# Altium schematic sheet VALIX_Font14.SchDoc
size D
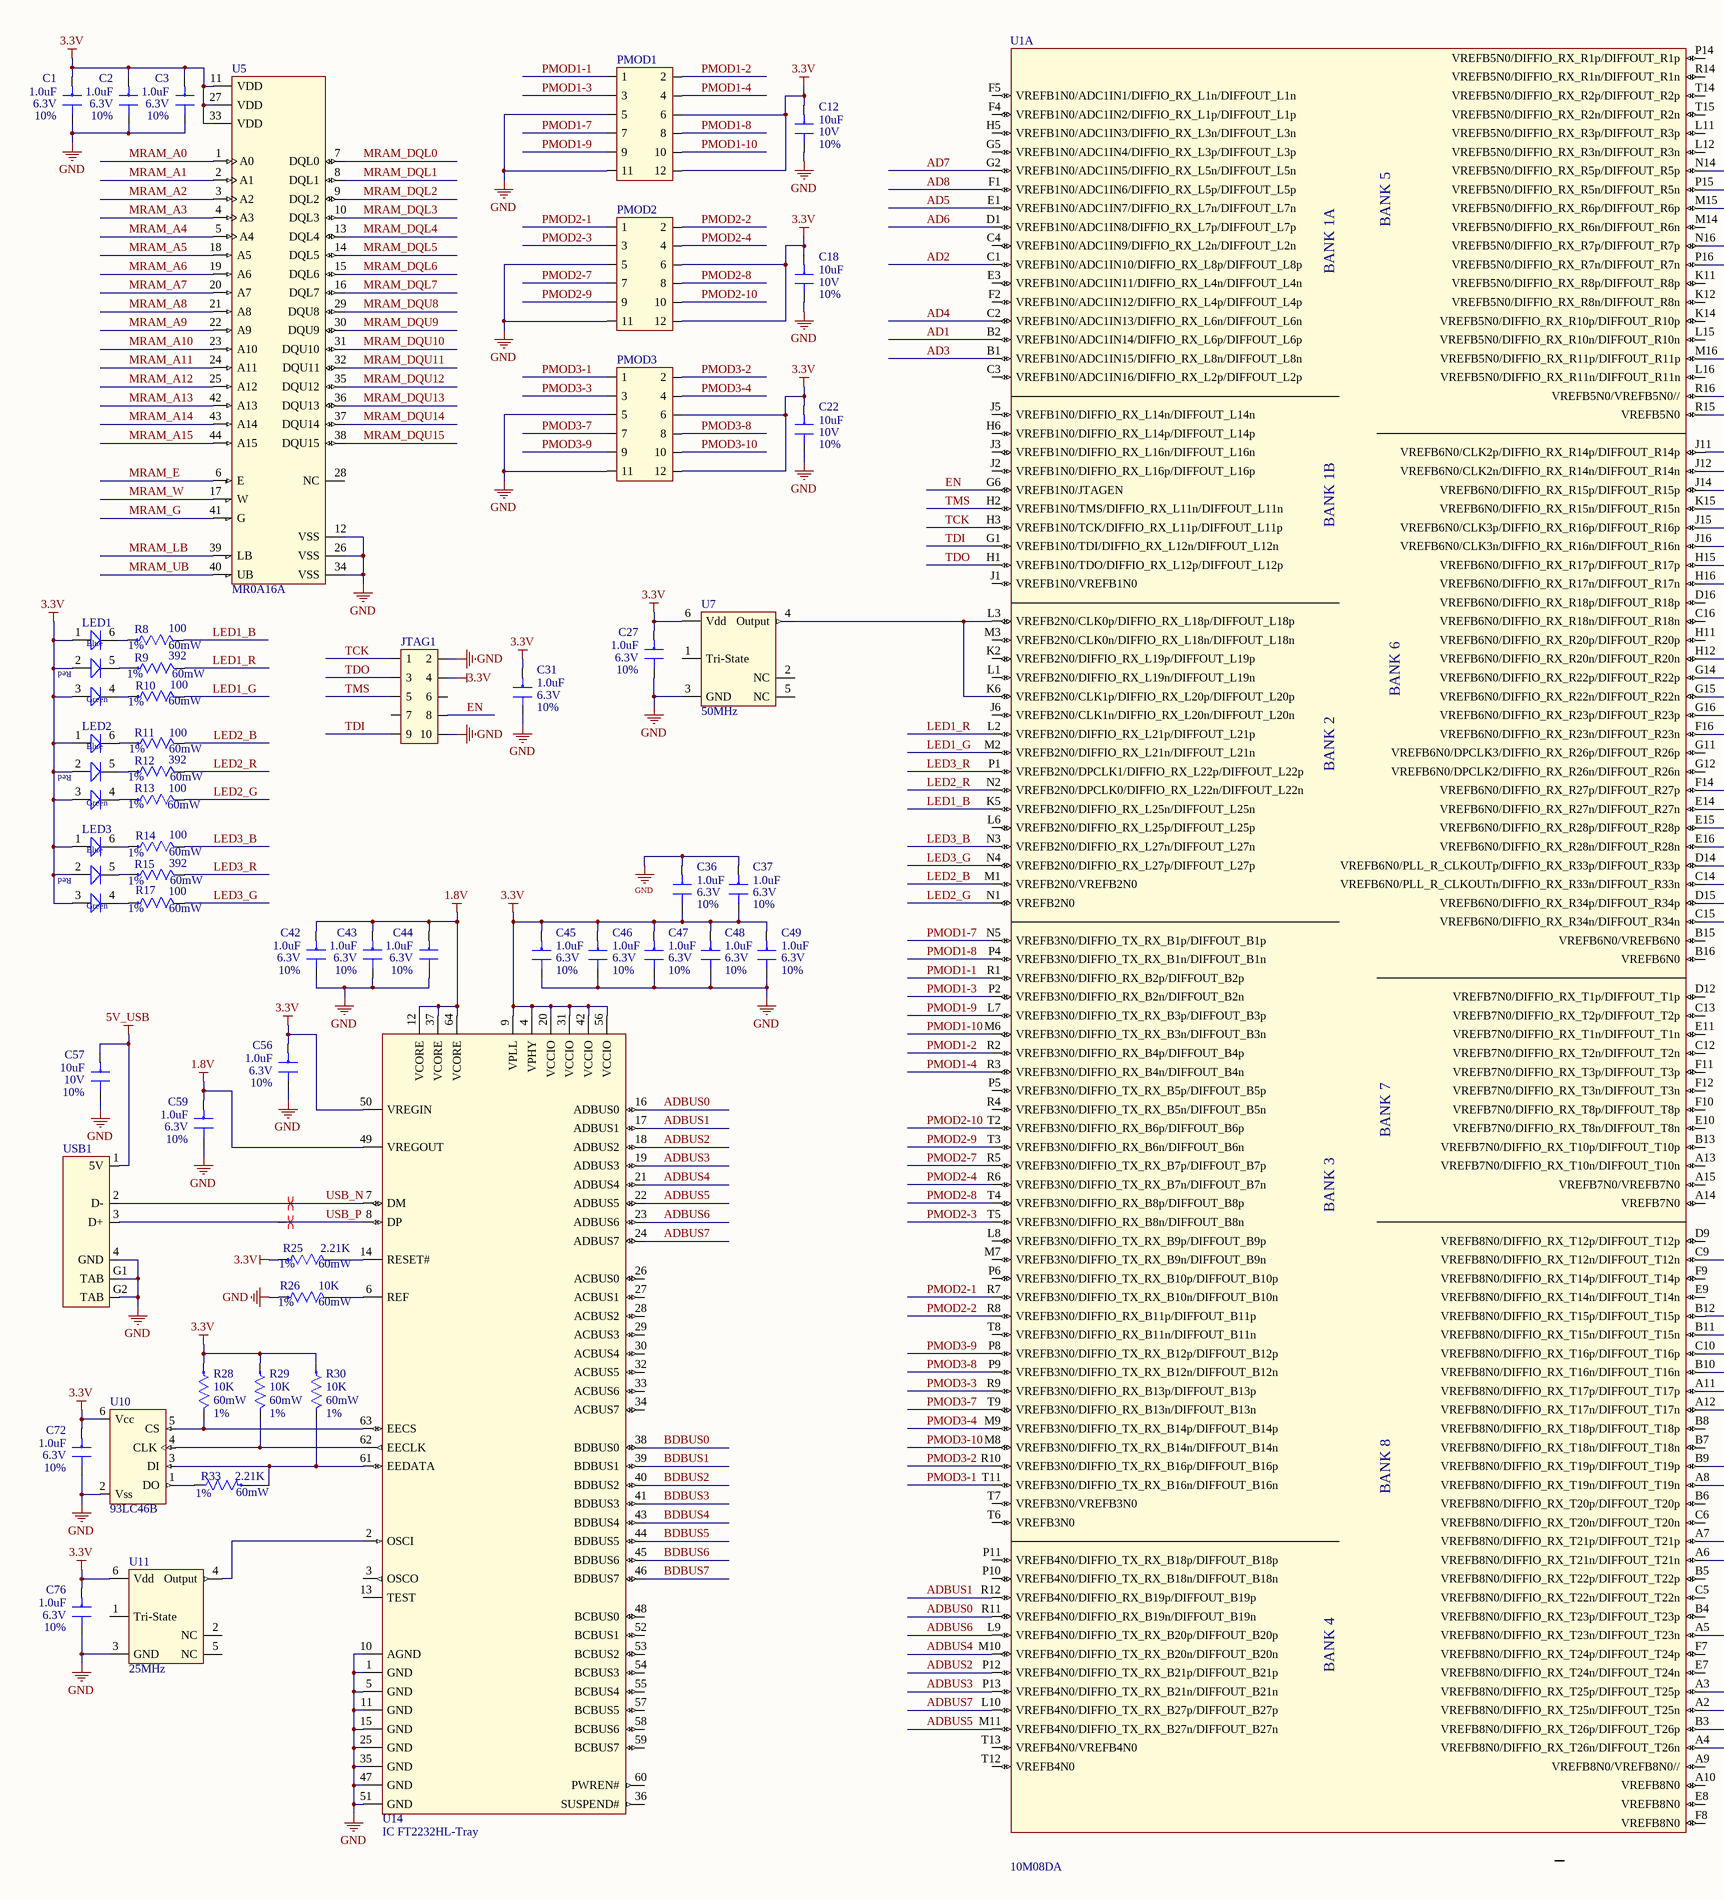
[diagram p0: VALIX_Font14.SchDoc, left]
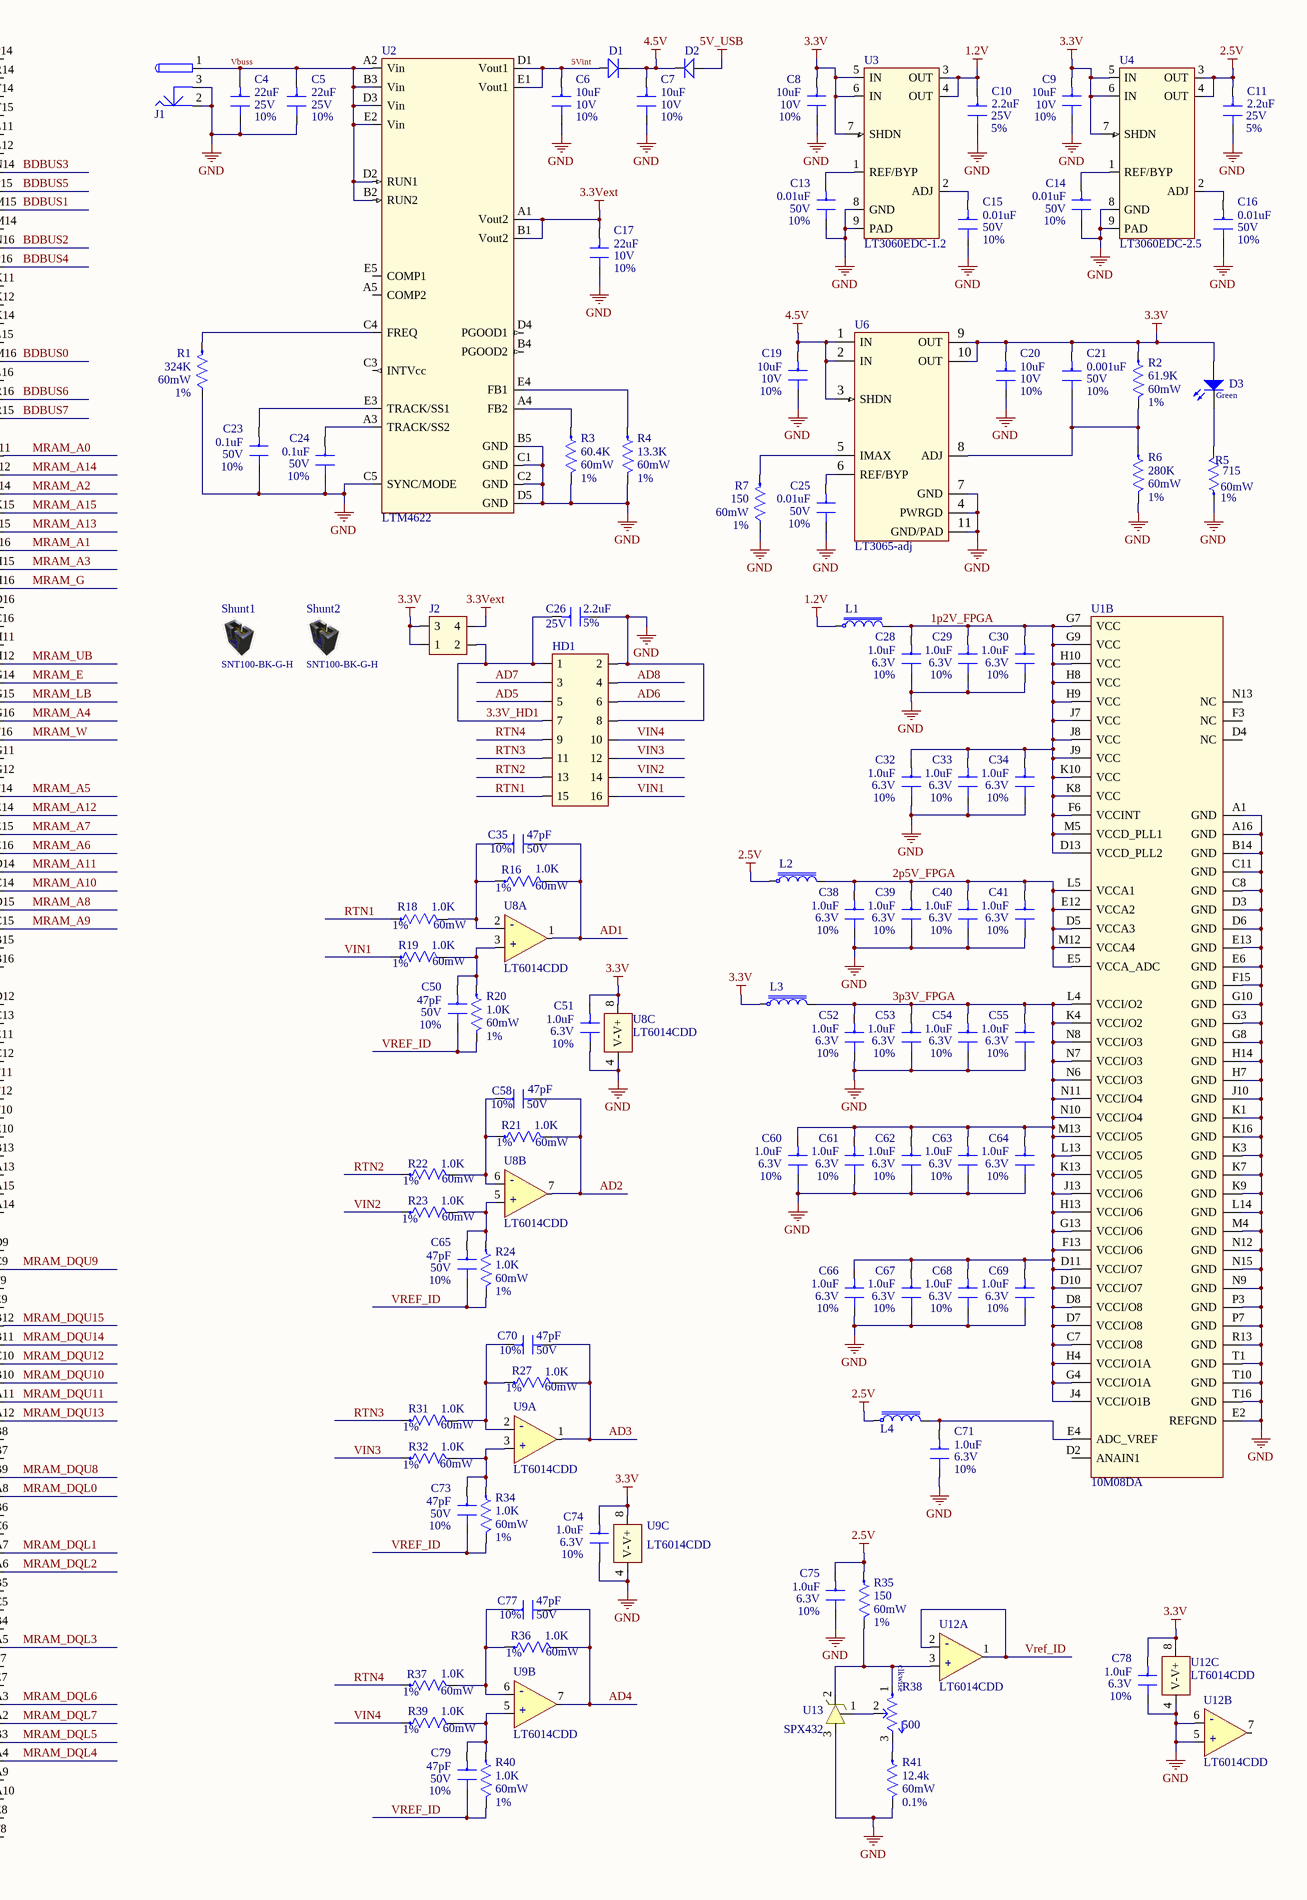
[diagram p1: VALIX_Font14.SchDoc, right]

## Parts
C1  value 1.0uF  Rating: 6.3V  Tolerance: 10%  [CC0402_p56_TLH]  (hidden comment: Cap 1.0uF 6.3V 0402 X7R)
C2  value 1.0uF  Rating: 6.3V  Tolerance: 10%  [CC0402_p56_TLH]  (hidden comment: Cap 1.0uF 6.3V 0402 X7R)
C3  value 1.0uF  Rating: 6.3V  Tolerance: 10%  [CC0402_p56_TLH]  (hidden comment: Cap 1.0uF 6.3V 0402 X7R)
C4  value 22uF  Rating: 25V  Tolerance: 10%  [CC1210_H1p6_20151019]  (hidden comment: Cap 22uF 10V 1210 X7R)
C5  value 22uF  Rating: 25V  Tolerance: 10%  [CC1210_H1p6_20151019]  (hidden comment: Cap 22uF 10V 1210 X7R)
C6  value 10uF  Rating: 10V  Tolerance: 10%  [CC0805_p94H_TLH]  (hidden comment: Cap 10uF 10V 0805 X7R)
C7  value 10uF  Rating: 10V  Tolerance: 10%  [CC0805_p94H_TLH]  (hidden comment: Cap 10uF 10V 0805 X7R)
C8  value 10uF  Rating: 10V  Tolerance: 10%  [CC0805_p94H_TLH]  (hidden comment: Cap 10uF 10V 0805 X7R)
C9  value 10uF  Rating: 10V  Tolerance: 10%  [CC0805_p94H_TLH]  (hidden comment: Cap 10uF 10V 0805 X7R)
C10  value 2.2uF  Rating: 25V  Tolerance: 5%  [CC0805_p94H_TLH]  (hidden comment: Cap 2.2uF 25V 0805 X7R)
C11  value 2.2uF  Rating: 25V  Tolerance: 5%  [CC0805_p94H_TLH]  (hidden comment: Cap 2.2uF 25V 0805 X7R)
C12  value 10uF  Rating: 10V  Tolerance: 10%  [CC0805_p94H_TLH]  (hidden comment: Cap 10uF 10V 0805 X7R)
C13  value 0.01uF  Rating: 50V  Tolerance: 10%  [CC0402_p56_TLH]  (hidden comment: Cap 0.01uF 50V 0402 X7R)
C14  value 0.01uF  Rating: 50V  Tolerance: 10%  [CC0402_p56_TLH]  (hidden comment: Cap 0.01uF 50V 0402 X7R)
C15  value 0.01uF  Rating: 50V  Tolerance: 10%  [CC0402_p56_TLH]  (hidden comment: Cap 0.01uF 50V 0402 X7R)
C16  value 0.01uF  Rating: 50V  Tolerance: 10%  [CC0402_p56_TLH]  (hidden comment: Cap 0.01uF 50V 0402 X7R)
C17  value 22uF  Rating: 10V  Tolerance: 10%  [C1206]  (hidden comment: Cap 22uF 10V 1206 X7R)
C18  value 10uF  Rating: 10V  Tolerance: 10%  [CC0805_p94H_TLH]  (hidden comment: Cap 10uF 10V 0805 X7R)
C19  value 10uF  Rating: 10V  Tolerance: 10%  [CC0805_p94H_TLH]  (hidden comment: Cap 10uF 10V 0805 X7R)
C20  value 10uF  Rating: 10V  Tolerance: 10%  [CC0805_p94H_TLH]  (hidden comment: Cap 10uF 10V 0805 X7R)
C21  value 0.001uF  Rating: 50V  Tolerance: 10%  [CC0402_p56_TLH]  (hidden comment: Cap 0.001uF 50V 0402 X7R)
C22  value 10uF  Rating: 10V  Tolerance: 10%  [CC0805_p94H_TLH]  (hidden comment: Cap 10uF 10V 0805 X7R)
C23  value 0.1uF  Rating: 50V  Tolerance: 10%  [CC0402_p56_TLH]  (hidden comment: Cap 0.1uF 50V 0402 X7R)
C24  value 0.1uF  Rating: 50V  Tolerance: 10%  [CC0402_p56_TLH]  (hidden comment: Cap 0.1uF 50V 0402 X7R)
C25  value 0.01uF  Rating: 50V  Tolerance: 10%  [CC0402_p56_TLH]  (hidden comment: Cap 0.01uF 50V 0402 X7R)
C26  value 2.2uF  Rating: 25V  Tolerance: 5%  [CC0805_p94H_TLH]  (hidden comment: Cap 2.2uF 25V 0805 X7R)
C27  value 1.0uF  Rating: 6.3V  Tolerance: 10%  [CC0402_p56_TLH]  (hidden comment: Cap 1.0uF 6.3V 0402 X7R)
C28  value 1.0uF  Rating: 6.3V  Tolerance: 10%  [CC0402_p56_TLH]  (hidden comment: Cap 1.0uF 6.3V 0402 X7R)
C29  value 1.0uF  Rating: 6.3V  Tolerance: 10%  [CC0402_p56_TLH]  (hidden comment: Cap 1.0uF 6.3V 0402 X7R)
C30  value 1.0uF  Rating: 6.3V  Tolerance: 10%  [CC0402_p56_TLH]  (hidden comment: Cap 1.0uF 6.3V 0402 X7R)
C31  value 1.0uF  Rating: 6.3V  Tolerance: 10%  [CC0402_p56_TLH]  (hidden comment: Cap 1.0uF 6.3V 0402 X7R)
C32  value 1.0uF  Rating: 6.3V  Tolerance: 10%  [CC0402_p56_TLH]  (hidden comment: Cap 1.0uF 6.3V 0402 X7R)
C33  value 1.0uF  Rating: 6.3V  Tolerance: 10%  [CC0402_p56_TLH]  (hidden comment: Cap 1.0uF 6.3V 0402 X7R)
C34  value 1.0uF  Rating: 6.3V  Tolerance: 10%  [CC0402_p56_TLH]  (hidden comment: Cap 1.0uF 6.3V 0402 X7R)
C35  value 47pF  Rating: 50V  Tolerance: 10%  [CC0402_p56_TLH]  (hidden comment: Cap 47pF 50V 0402 NPO)
C36  value 1.0uF  Rating: 6.3V  Tolerance: 10%  [CC0402_p56_TLH]  (hidden comment: Cap 1.0uF 6.3V 0402 X7R)
C37  value 1.0uF  Rating: 6.3V  Tolerance: 10%  [CC0402_p56_TLH]  (hidden comment: Cap 1.0uF 6.3V 0402 X7R)
C38  value 1.0uF  Rating: 6.3V  Tolerance: 10%  [CC0402_p56_TLH]  (hidden comment: Cap 1.0uF 6.3V 0402 X7R)
C39  value 1.0uF  Rating: 6.3V  Tolerance: 10%  [CC0402_p56_TLH]  (hidden comment: Cap 1.0uF 6.3V 0402 X7R)
C40  value 1.0uF  Rating: 6.3V  Tolerance: 10%  [CC0402_p56_TLH]  (hidden comment: Cap 1.0uF 6.3V 0402 X7R)
C41  value 1.0uF  Rating: 6.3V  Tolerance: 10%  [CC0402_p56_TLH]  (hidden comment: Cap 1.0uF 6.3V 0402 X7R)
C42  value 1.0uF  Rating: 6.3V  Tolerance: 10%  [CC0402_p56_TLH]  (hidden comment: Cap 1.0uF 6.3V 0402 X7R)
C43  value 1.0uF  Rating: 6.3V  Tolerance: 10%  [CC0402_p56_TLH]  (hidden comment: Cap 1.0uF 6.3V 0402 X7R)
C44  value 1.0uF  Rating: 6.3V  Tolerance: 10%  [CC0402_p56_TLH]  (hidden comment: Cap 1.0uF 6.3V 0402 X7R)
C45  value 1.0uF  Rating: 6.3V  Tolerance: 10%  [CC0402_p56_TLH]  (hidden comment: Cap 1.0uF 6.3V 0402 X7R)
C46  value 1.0uF  Rating: 6.3V  Tolerance: 10%  [CC0402_p56_TLH]  (hidden comment: Cap 1.0uF 6.3V 0402 X7R)
C47  value 1.0uF  Rating: 6.3V  Tolerance: 10%  [CC0402_p56_TLH]  (hidden comment: Cap 1.0uF 6.3V 0402 X7R)
C48  value 1.0uF  Rating: 6.3V  Tolerance: 10%  [CC0402_p56_TLH]  (hidden comment: Cap 1.0uF 6.3V 0402 X7R)
C49  value 1.0uF  Rating: 6.3V  Tolerance: 10%  [CC0402_p56_TLH]  (hidden comment: Cap 1.0uF 6.3V 0402 X7R)
C50  value 47pF  Rating: 50V  Tolerance: 10%  [CC0402_p56_TLH]  (hidden comment: Cap 47pF 50V 0402 NPO)
C51  value 1.0uF  Rating: 6.3V  Tolerance: 10%  [CC0402_p56_TLH]  (hidden comment: Cap 1.0uF 6.3V 0402 X7R)
C52  value 1.0uF  Rating: 6.3V  Tolerance: 10%  [CC0402_p56_TLH]  (hidden comment: Cap 1.0uF 6.3V 0402 X7R)
C53  value 1.0uF  Rating: 6.3V  Tolerance: 10%  [CC0402_p56_TLH]  (hidden comment: Cap 1.0uF 6.3V 0402 X7R)
C54  value 1.0uF  Rating: 6.3V  Tolerance: 10%  [CC0402_p56_TLH]  (hidden comment: Cap 1.0uF 6.3V 0402 X7R)
C55  value 1.0uF  Rating: 6.3V  Tolerance: 10%  [CC0402_p56_TLH]  (hidden comment: Cap 1.0uF 6.3V 0402 X7R)
C56  value 1.0uF  Rating: 6.3V  Tolerance: 10%  [CC0402_p56_TLH]  (hidden comment: Cap 1.0uF 6.3V 0402 X7R)
C57  value 10uF  Rating: 10V  Tolerance: 10%  [CC0805_p94H_TLH]  (hidden comment: Cap 10uF 10V 0805 X7R)
C58  value 47pF  Rating: 50V  Tolerance: 10%  [CC0402_p56_TLH]  (hidden comment: Cap 47pF 50V 0402 NPO)
C59  value 1.0uF  Rating: 6.3V  Tolerance: 10%  [CC0402_p56_TLH]  (hidden comment: Cap 1.0uF 6.3V 0402 X7R)
C60  value 1.0uF  Rating: 6.3V  Tolerance: 10%  [CC0402_p56_TLH]  (hidden comment: Cap 1.0uF 6.3V 0402 X7R)
C61  value 1.0uF  Rating: 6.3V  Tolerance: 10%  [CC0402_p56_TLH]  (hidden comment: Cap 1.0uF 6.3V 0402 X7R)
C62  value 1.0uF  Rating: 6.3V  Tolerance: 10%  [CC0402_p56_TLH]  (hidden comment: Cap 1.0uF 6.3V 0402 X7R)
C63  value 1.0uF  Rating: 6.3V  Tolerance: 10%  [CC0402_p56_TLH]  (hidden comment: Cap 1.0uF 6.3V 0402 X7R)
C64  value 1.0uF  Rating: 6.3V  Tolerance: 10%  [CC0402_p56_TLH]  (hidden comment: Cap 1.0uF 6.3V 0402 X7R)
C65  value 47pF  Rating: 50V  Tolerance: 10%  [CC0402_p56_TLH]  (hidden comment: Cap 47pF 50V 0402 NPO)
C66  value 1.0uF  Rating: 6.3V  Tolerance: 10%  [CC0402_p56_TLH]  (hidden comment: Cap 1.0uF 6.3V 0402 X7R)
C67  value 1.0uF  Rating: 6.3V  Tolerance: 10%  [CC0402_p56_TLH]  (hidden comment: Cap 1.0uF 6.3V 0402 X7R)
C68  value 1.0uF  Rating: 6.3V  Tolerance: 10%  [CC0402_p56_TLH]  (hidden comment: Cap 1.0uF 6.3V 0402 X7R)
C69  value 1.0uF  Rating: 6.3V  Tolerance: 10%  [CC0402_p56_TLH]  (hidden comment: Cap 1.0uF 6.3V 0402 X7R)
C70  value 47pF  Rating: 50V  Tolerance: 10%  [CC0402_p56_TLH]  (hidden comment: Cap 47pF 50V 0402 NPO)
C71  value 1.0uF  Rating: 6.3V  Tolerance: 10%  [CC0402_p56_TLH]  (hidden comment: Cap 1.0uF 6.3V 0402 X7R)
C72  value 1.0uF  Rating: 6.3V  Tolerance: 10%  [CC0402_p56_TLH]  (hidden comment: Cap 1.0uF 6.3V 0402 X7R)
C73  value 47pF  Rating: 50V  Tolerance: 10%  [CC0402_p56_TLH]  (hidden comment: Cap 47pF 50V 0402 NPO)
C74  value 1.0uF  Rating: 6.3V  Tolerance: 10%  [CC0402_p56_TLH]  (hidden comment: Cap 1.0uF 6.3V 0402 X7R)
C75  value 1.0uF  Rating: 6.3V  Tolerance: 10%  [CC0402_p56_TLH]  (hidden comment: Cap 1.0uF 6.3V 0402 X7R)
C76  value 1.0uF  Rating: 6.3V  Tolerance: 10%  [CC0402_p56_TLH]  (hidden comment: Cap 1.0uF 6.3V 0402 X7R)
C77  value 47pF  Rating: 50V  Tolerance: 10%  [CC0402_p56_TLH]  (hidden comment: Cap 47pF 50V 0402 NPO)
C78  value 1.0uF  Rating: 6.3V  Tolerance: 10%  [CC0402_p56_TLH]  (hidden comment: Cap 1.0uF 6.3V 0402 X7R)
C79  value 47pF  Rating: 50V  Tolerance: 10%  [CC0402_p56_TLH]  (hidden comment: Cap 47pF 50V 0402 NPO)
D1  Diode 40V 3A  [SMA_SOICJ127P600-8N]  (value not drawn)
D2  Diode 40V 3A  [SMA_SOICJ127P600-8N]  (value not drawn)
D3  Color: Green  [CC0402_p56_TLH - LED]  (hidden comment: SML-P11MT)
HD1  Conn Recept 8x2x0.1 TH SSW  [Conn Recept 8x2x8p35 0p1PH TH]  (value not drawn)
J1  Conn PWR 2.0 5A 24V TH Barrel  [KLD-0202]  (value not drawn)
J2  Header 2x2 100Pitch  [Header_2x2x0p100e]  (value not drawn)
JTAG1  Header 2x5 100Pitch  [Header_2x5_100x100]  (value not drawn)
L1  FB 0.5A 80mohm 0402  [Chip2PinSM127P600-8N_TLH20150921]  (value not drawn)
L2  FB 0.5A 80mohm 0402  [Chip2PinSM127P600-8N_TLH20150921]  (value not drawn)
L3  FB 0.5A 80mohm 0402  [Chip2PinSM127P600-8N_TLH20150921]  (value not drawn)
L4  FB 0.5A 80mohm 0402  [Chip2PinSM127P600-8N_TLH20150921]  (value not drawn)
LED1  LED RGB  [LED_RGB_1p5x1p0x0p2_6pin_SON57P100X256N]  (value not drawn)
LED2  LED RGB  [LED_RGB_1p5x1p0x0p2_6pin_SON57P100X256N]  (value not drawn)
LED3  LED RGB  [LED_RGB_1p5x1p0x0p2_6pin_SON57P100X256N]  (value not drawn)
PMOD1  Conn Recept 6x2x0.1 TH SSW  [Conn Recept 6x2x8p35 0p1PH TH]  (value not drawn)
PMOD2  Conn Recept 6x2x0.1 TH SSW  [Conn Recept 6x2x8p35 0p1PH TH]  (value not drawn)
PMOD3  Conn Recept 6x2x0.1 TH SSW  [Conn Recept 6x2x8p35 0p1PH TH]  (value not drawn)
R1  Rating: 60mW  Tolerance: 1%  [CC0402_p56_TLH]  (hidden comment: 324K)
R2  Rating: 60mW  Tolerance: 1%  [CC0402_p56_TLH]  (hidden comment: 61.9K)
R3  Rating: 60mW  Tolerance: 1%  [CC0402_p56_TLH]  (hidden comment: 60.4K)
R4  Rating: 60mW  Tolerance: 1%  [CC0402_p56_TLH]  (hidden comment: 13.3K)
R5  Rating: 60mW  Tolerance: 1%  [CC0402_p56_TLH]  (hidden comment: 715)
R6  Rating: 60mW  Tolerance: 1%  [CC0402_p56_TLH]  (hidden comment: 280K)
R7  Rating: 60mW  Tolerance: 1%  [CC0402_p56_TLH]  (hidden comment: 150)
R8  Rating: 60mW  Tolerance: 1%  [CC0402_p56_TLH]  (hidden comment: 100)
R9  Rating: 60mW  Tolerance: 1%  [CC0402_p56_TLH]  (hidden comment: 392)
R10  Rating: 60mW  Tolerance: 1%  [CC0402_p56_TLH]  (hidden comment: 100)
R11  Rating: 60mW  Tolerance: 1%  [CC0402_p56_TLH]  (hidden comment: 100)
R12  Rating: 60mW  Tolerance: 1%  [CC0402_p56_TLH]  (hidden comment: 392)
R13  Rating: 60mW  Tolerance: 1%  [CC0402_p56_TLH]  (hidden comment: 100)
R14  Rating: 60mW  Tolerance: 1%  [CC0402_p56_TLH]  (hidden comment: 100)
R15  Rating: 60mW  Tolerance: 1%  [CC0402_p56_TLH]  (hidden comment: 392)
R16  Rating: 60mW  Tolerance: 1%  [CC0402_p56_TLH]  (hidden comment: 1.0K)
R17  Rating: 60mW  Tolerance: 1%  [CC0402_p56_TLH]  (hidden comment: 100)
R18  Rating: 60mW  Tolerance: 1%  [CC0402_p56_TLH]  (hidden comment: 1.0K)
R19  Rating: 60mW  Tolerance: 1%  [CC0402_p56_TLH]  (hidden comment: 1.0K)
R20  Rating: 60mW  Tolerance: 1%  [CC0402_p56_TLH]  (hidden comment: 1.0K)
R21  Rating: 60mW  Tolerance: 1%  [CC0402_p56_TLH]  (hidden comment: 1.0K)
R22  Rating: 60mW  Tolerance: 1%  [CC0402_p56_TLH]  (hidden comment: 1.0K)
R23  Rating: 60mW  Tolerance: 1%  [CC0402_p56_TLH]  (hidden comment: 1.0K)
R24  Rating: 60mW  Tolerance: 1%  [CC0402_p56_TLH]  (hidden comment: 1.0K)
R25  Rating: 60mW  Tolerance: 1%  [CC0402_p56_TLH]  (hidden comment: 2.21K)
R26  Rating: 60mW  Tolerance: 1%  [CC0402_p56_TLH]  (hidden comment: 10K)
R27  Rating: 60mW  Tolerance: 1%  [CC0402_p56_TLH]  (hidden comment: 1.0K)
R28  Rating: 60mW  Tolerance: 1%  [CC0402_p56_TLH]  (hidden comment: 10K)
R29  Rating: 60mW  Tolerance: 1%  [CC0402_p56_TLH]  (hidden comment: 10K)
R30  Rating: 60mW  Tolerance: 1%  [CC0402_p56_TLH]  (hidden comment: 10K)
R31  Rating: 60mW  Tolerance: 1%  [CC0402_p56_TLH]  (hidden comment: 1.0K)
R32  Rating: 60mW  Tolerance: 1%  [CC0402_p56_TLH]  (hidden comment: 1.0K)
R33  Rating: 60mW  Tolerance: 1%  [CC0402_p56_TLH]  (hidden comment: 2.21K)
R34  Rating: 60mW  Tolerance: 1%  [CC0402_p56_TLH]  (hidden comment: 1.0K)
R35  Rating: 60mW  Tolerance: 1%  [CC0402_p56_TLH]  (hidden comment: 150)
R36  Rating: 60mW  Tolerance: 1%  [CC0402_p56_TLH]  (hidden comment: 1.0K)
R37  Rating: 60mW  Tolerance: 1%  [CC0402_p56_TLH]  (hidden comment: 1.0K)
R38  500  [RES_ Pot_3pin_318x231x416_Bourns3223W]
R39  Rating: 60mW  Tolerance: 1%  [CC0402_p56_TLH]  (hidden comment: 1.0K)
R40  Rating: 60mW  Tolerance: 1%  [CC0402_p56_TLH]  (hidden comment: 1.0K)
R41  Rating: 60mW  Tolerance: 0.1%  [CC0402_p56_TLH]  (hidden comment: 12.4k)
Shunt1  Manufacture Part number: SNT100-BK-G-H  (hidden comment: Shunt)  (mechanical)
Shunt2  Manufacture Part number: SNT100-BK-G-H  (hidden comment: Shunt)  (mechanical)
U1  10M08DA  [BGA256C100P16X16_1700X1700X155]  (parts A,B of 2)
U2  LTM4622  [LGA25C127P5X5_625X625X182_20131105]
U3  LT3060EDC-1.2  [DFN8_2x3_SON45P300X80_HS-9N]
U4  LT3060EDC-2.5  [DFN8_2x3_SON45P300X80_HS-9N]
U5  MR0A16A  [TSOP44_80P1180X120-44N]
U6  LT3065-adj  [DFN10_SON50P300X80_HS-11N_TLH_20151107]
U7  50MHz  [SON254P500X85_HS-7N_Oss]
U8  LT6014CDD  [DFN8_3x3_SON50P300X80_HS-9N_20151201]  (parts A,B,C of 3)
U9  LT6014CDD  [DFN8_3x3_SON50P300X80_HS-9N_20151201]  (parts A,B,C of 3)
U10  93LC46B  [SO-G6/E2.4]
U11  25MHz  [SON254P500X85_HS-7N_Oss]
U12  LT6014CDD  [DFN8_3x3_SON50P300X80_HS-9N_20151201]  (parts A,B,C of 3)
U13  SPX432  [SOT23_SOT95P245X112-3N_20151202]
U14  IC FT2232HL-Tray  [LQFP-64_N]
USB1  Conn USB A TH RT  [Connector USB A 4Pin Plug RT]  (value not drawn)

## Nets
1.2V: C10.1 L1.1 U3.3(OUT) U3.4(OUT)
1.8V: C42.1 C43.1 C44.1 C59.1 U14.12(VCORE) U14.37(VCORE) U14.49(VREGOUT) U14.64(VCORE)
2.5V: C11.1 C75.1 L2.1 L4.1 R35.1 U4.3(OUT) U4.4(OUT)
3.3V: C1.1 C2.1 C3.1 C8.1 C9.1 C12.1 C18.1 C20.1 C21.1 C22.1 C27.1 C31.1 C36.2 C37.2 C45.1 C46.1 C47.1 C48.1 C49.1 C51.1 C56.1 C72.1 C74.1 C76.1 C78.1 D3.1(A) J2.1 J2.3 JTAG1.4 L3.1 LED1.1(BLue_Anode) LED1.2(Red_Anode) LED1.3(Green_Anode) LED2.1(BLue_Anode) LED2.2(Red_Anode) LED2.3(Green_Anode) LED3.1(BLue_Anode) LED3.2(Red_Anode) LED3.3(Green_Anode) PMOD1.6 PMOD1.12 PMOD2.6 PMOD2.12 PMOD3.6 PMOD3.12 R2.1 R25.1 R28.1 R29.1 R30.1 U3.5(IN) U3.6(IN) U3.7(SHDN) U4.5(IN) U4.6(IN) U4.7(SHDN) U5.11(VDD) U5.27(VDD) U5.33(VDD) U6.9(OUT) U6.10(OUT) U7.6(Vdd) U8.8(V+) U9.8(V+) U10.6(Vcc) U11.6(Vdd) U12.8(V+) U14.4(VPHY) U14.9(VPLL) U14.20(VCCIO) U14.31(VCCIO) U14.42(VCCIO) U14.50(VREGIN) U14.56(VCCIO)
3.3Vext: C17.1 J2.4 U2.A1(Vout2) U2.B1(Vout2)
4.5V: C7.1 C19.1 D1.1(C_NEG) D2.1(C_NEG) U6.1(IN) U6.2(IN) U6.3(SHDN)
5V_USB: C57.1 D2.2(A_POS) USB1.1(5V)
GND: C1.2 C2.2 C3.2 C4.2 C5.2 C6.2 C7.2 C8.2 C9.2 C10.2 C11.2 C12.2 C13.2 C14.2 C15.2 C16.2 C17.2 C18.2 C19.2 C20.2 C22.2 C23.2 C24.2 C25.2 C26.2 C27.2 C28.2 C29.2 C30.2 C31.2 C32.2 C33.2 C34.2 C36.1 C37.1 C38.2 C39.2 C40.2 C41.2 C42.2 C43.2 C44.2 C45.2 C46.2 C47.2 C48.2 C49.2 C51.2 C52.2 C53.2 C54.2 C55.2 C56.2 C57.2 C59.2 C60.2 C61.2 C62.2 C63.2 C64.2 C66.2 C67.2 C68.2 C69.2 C71.2 C72.2 C74.2 C75.2 C76.2 C78.2 HD1.2 HD1.8 J1.2 J1.3 JTAG1.2 JTAG1.10 PMOD1.5 PMOD1.11 PMOD2.5 PMOD2.11 PMOD3.5 PMOD3.11 R1.2 R3.2 R4.2 R5.1 R6.2 R7.2 R26.1 R41.2 U1.A1(GND) U1.A16(GND) U1.B14(GND) U1.C8(GND) U1.C11(GND) U1.D3(GND) U1.D6(GND) U1.E2(REFGND) U1.E6(GND) U1.E13(GND) U1.F15(GND) U1.G3(GND) U1.G8(GND) U1.G10(GND) U1.H7(GND) U1.H14(GND) U1.J10(GND) U1.K1(GND) U1.K3(GND) U1.K7(GND) U1.K9(GND) U1.K16(GND) U1.L14(GND) U1.M4(GND) U1.N9(GND) U1.N12(GND) U1.N15(GND) U1.P3(GND) U1.P7(GND) U1.R13(GND) U1.T1(GND) U1.T10(GND) U1.T16(GND) U2.B5(GND) U2.C1(GND) U2.C2(GND) U2.C5(SYNC/MODE) U2.D5(GND) U3.8(GND) U3.9(PAD) U4.8(GND) U4.9(PAD) U5.12(VSS) U5.26(VSS) U5.34(VSS) U6.4(PWRGD) U6.7(GND) U6.11(GND/PAD) U7.3(GND) U8.4(V-) U9.4(V-) U10.2(Vss) U11.3(GND) U12.4(V-) U12.5(+) U12.6(inb-) U13.3(Anode) U14.1(GND) U14.5(GND) U14.10(AGND) U14.11(GND) U14.15(GND) U14.25(GND) U14.35(GND) U14.47(GND) U14.51(GND) USB1.4(GND) USB1.G1(TAB) USB1.G2(TAB)
1p2V_FPGA: C28.1 C29.1 C30.1 C32.1 C33.1 C34.1 L1.2 U1.D13(VCCD_PLL2) U1.F6(VCCINT) U1.G7(VCC) U1.G9(VCC) U1.H8(VCC) U1.H9(VCC) U1.H10(VCC) U1.J7(VCC) U1.J8(VCC) U1.J9(VCC) U1.K8(VCC) U1.K10(VCC) U1.M5(VCCD_PLL1)
2p5V_FPGA: C38.1 C39.1 C40.1 C41.1 L2.2 U1.D5(VCCA3) U1.E5(VCCA_ADC) U1.E12(VCCA2) U1.L5(VCCA1) U1.M12(VCCA4)
3.3V_HD1: C26.1 HD1.1 HD1.7 J2.2
3p3V_FPGA: C52.1 C53.1 C54.1 C55.1 C60.1 C61.1 C62.1 C63.1 C64.1 C66.1 C67.1 C68.1 C69.1 L3.2 U1.C7(VCCI/O8) U1.D7(VCCI/O8) U1.D8(VCCI/O8) U1.D10(VCCI/O7) U1.D11(VCCI/O7) U1.F13(VCCI/O6) U1.G4(VCCI/O1A) U1.G13(VCCI/O6) U1.H4(VCCI/O1A) U1.H13(VCCI/O6) U1.J4(VCCI/O1B) U1.J13(VCCI/O6) U1.K4(VCCI/O2) U1.K13(VCCI/O5) U1.L4(VCCI/O2) U1.L13(VCCI/O5) U1.M13(VCCI/O5) U1.N6(VCCI/O3) U1.N7(VCCI/O3) U1.N8(VCCI/O3) U1.N10(VCCI/O4) U1.N11(VCCI/O4)
5Vint: C6.1 D1.2(A_POS) U2.D1(Vout1) U2.E1(Vout1)
AD1: C35.2 R16.2 U1.B2(VREFB1N0/ADC1IN14/DIFFIO_RX_L6p/DIFFOUT_L6p) U8.1(Vouta)
AD2: C58.2 R21.2 U1.C1(VREFB1N0/ADC1IN10/DIFFIO_RX_L8p/DIFFOUT_L8p) U8.7(Voutb)
AD3: C70.2 R27.2 U1.B1(VREFB1N0/ADC1IN15/DIFFIO_RX_L8n/DIFFOUT_L8n) U9.1(Vouta)
AD4: C77.2 R36.2 U1.C2(VREFB1N0/ADC1IN13/DIFFIO_RX_L6n/DIFFOUT_L6n) U9.7(Voutb)
AD5: HD1.5 U1.E1(VREFB1N0/ADC1IN7/DIFFIO_RX_L7n/DIFFOUT_L7n)
AD6: HD1.6 U1.D1(VREFB1N0/ADC1IN8/DIFFIO_RX_L7p/DIFFOUT_L7p)
AD7: HD1.3 U1.G2(VREFB1N0/ADC1IN5/DIFFIO_RX_L5n/DIFFOUT_L5n)
AD8: HD1.4 U1.F1(VREFB1N0/ADC1IN6/DIFFIO_RX_L5p/DIFFOUT_L5p)
ADBUS0: U1.R11(VREFB4N0/DIFFIO_RX_B19n/DIFFOUT_B19n) U14.16(ADBUS0)
ADBUS1: U1.R12(VREFB4N0/DIFFIO_RX_B19p/DIFFOUT_B19p) U14.17(ADBUS1)
ADBUS2: U1.P12(VREFB4N0/DIFFIO_TX_RX_B21p/DIFFOUT_B21p) U14.18(ADBUS2)
ADBUS3: U1.P13(VREFB4N0/DIFFIO_TX_RX_B21n/DIFFOUT_B21n) U14.19(ADBUS3)
ADBUS4: U1.M10(VREFB4N0/DIFFIO_TX_RX_B20n/DIFFOUT_B20n) U14.21(ADBUS4)
ADBUS5: U1.M11(VREFB4N0/DIFFIO_TX_RX_B27n/DIFFOUT_B27n) U14.22(ADBUS5)
ADBUS6: U1.L9(VREFB4N0/DIFFIO_TX_RX_B20p/DIFFOUT_B20p) U14.23(ADBUS6)
ADBUS7: U1.L10(VREFB4N0/DIFFIO_TX_RX_B27p/DIFFOUT_B27p) U14.24(ADBUS7)
BDBUS0: U1.M16(VREFB5N0/DIFFIO_RX_R11p/DIFFOUT_R11p) U14.38(BDBUS0)
BDBUS1: U1.M15(VREFB5N0/DIFFIO_RX_R6p/DIFFOUT_R6p) U14.39(BDBUS1)
BDBUS2: U1.N16(VREFB5N0/DIFFIO_RX_R7p/DIFFOUT_R7p) U14.40(BDBUS2)
BDBUS3: U1.N14(VREFB5N0/DIFFIO_RX_R5p/DIFFOUT_R5p) U14.41(BDBUS3)
BDBUS4: U1.P16(VREFB5N0/DIFFIO_RX_R7n/DIFFOUT_R7n) U14.43(BDBUS4)
BDBUS5: U1.P15(VREFB5N0/DIFFIO_RX_R5n/DIFFOUT_R5n) U14.44(BDBUS5)
BDBUS6: U1.R16(VREFB5N0/VREFB5N0//) U14.45(BDBUS6)
BDBUS7: U1.R15(VREFB5N0) U14.46(BDBUS7)
EN: JTAG1.8 U1.G6(VREFB1N0/JTAGEN)
LED1_B: R8.2 U1.K5(VREFB2N0/DIFFIO_RX_L25n/DIFFOUT_L25n)
LED1_G: R10.2 U1.M2(VREFB2N0/DIFFIO_RX_L21n/DIFFOUT_L21n)
LED1_R: R9.2 U1.L2(VREFB2N0/DIFFIO_RX_L21p/DIFFOUT_L21p)
LED2_B: R11.2 U1.M1(VREFB2N0/VREFB2N0)
LED2_G: R13.2 U1.N1(VREFB2N0)
LED2_R: R12.2 U1.N2(VREFB2N0/DPCLK0/DIFFIO_RX_L22n/DIFFOUT_L22n)
LED3_B: R14.2 U1.N3(VREFB2N0/DIFFIO_RX_L27n/DIFFOUT_L27n)
LED3_G: R17.2 U1.N4(VREFB2N0/DIFFIO_RX_L27p/DIFFOUT_L27p)
LED3_R: R15.2 U1.P1(VREFB2N0/DPCLK1/DIFFIO_RX_L22p/DIFFOUT_L22p)
MRAM_A0: U1.J11(VREFB6N0/CLK2p/DIFFIO_RX_R14p/DIFFOUT_R14p) U5.1(A0)
MRAM_A1: U1.J16(VREFB6N0/CLK3n/DIFFIO_RX_R16n/DIFFOUT_R16n) U5.2(A1)
MRAM_A2: U1.J14(VREFB6N0/DIFFIO_RX_R15p/DIFFOUT_R15p) U5.3(A2)
MRAM_A3: U1.H15(VREFB6N0/DIFFIO_RX_R17p/DIFFOUT_R17p) U5.4(A3)
MRAM_A4: U1.G16(VREFB6N0/DIFFIO_RX_R23p/DIFFOUT_R23p) U5.5(A4)
MRAM_A5: U1.F14(VREFB6N0/DIFFIO_RX_R27p/DIFFOUT_R27p) U5.18(A5)
MRAM_A6: U1.E16(VREFB6N0/DIFFIO_RX_R28n/DIFFOUT_R28n) U5.19(A6)
MRAM_A7: U1.E15(VREFB6N0/DIFFIO_RX_R28p/DIFFOUT_R28p) U5.20(A7)
MRAM_A8: U1.D15(VREFB6N0/DIFFIO_RX_R34p/DIFFOUT_R34p) U5.21(A8)
MRAM_A9: U1.C15(VREFB6N0/DIFFIO_RX_R34n/DIFFOUT_R34n) U5.22(A9)
MRAM_A10: U1.C14(VREFB6N0/PLL_R_CLKOUTn/DIFFIO_RX_R33n/DIFFOUT_R33n) U5.23(A10)
MRAM_A11: U1.D14(VREFB6N0/PLL_R_CLKOUTp/DIFFIO_RX_R33p/DIFFOUT_R33p) U5.24(A11)
MRAM_A12: U1.E14(VREFB6N0/DIFFIO_RX_R27n/DIFFOUT_R27n) U5.25(A12)
MRAM_A13: U1.J15(VREFB6N0/CLK3p/DIFFIO_RX_R16p/DIFFOUT_R16p) U5.42(A13)
MRAM_A14: U1.J12(VREFB6N0/CLK2n/DIFFIO_RX_R14n/DIFFOUT_R14n) U5.43(A14)
MRAM_A15: U1.K15(VREFB6N0/DIFFIO_RX_R15n/DIFFOUT_R15n) U5.44(A15)
MRAM_DQL0: U1.A8(VREFB8N0/DIFFIO_RX_T19n/DIFFOUT_T19n) U5.7(DQL0)
MRAM_DQL1: U1.A7(VREFB8N0/DIFFIO_RX_T21p/DIFFOUT_T21p) U5.8(DQL1)
MRAM_DQL2: U1.A6(VREFB8N0/DIFFIO_RX_T21n/DIFFOUT_T21n) U5.9(DQL2)
MRAM_DQL3: U1.A5(VREFB8N0/DIFFIO_RX_T23n/DIFFOUT_T23n) U5.10(DQL3)
MRAM_DQL4: U1.A4(VREFB8N0/DIFFIO_RX_T26n/DIFFOUT_T26n) U5.13(DQL4)
MRAM_DQL5: U1.B3(VREFB8N0/DIFFIO_RX_T26p/DIFFOUT_T26p) U5.14(DQL5)
MRAM_DQL6: U1.A3(VREFB8N0/DIFFIO_RX_T25p/DIFFOUT_T25p) U5.15(DQL6)
MRAM_DQL7: U1.A2(VREFB8N0/DIFFIO_RX_T25n/DIFFOUT_T25n) U5.16(DQL7)
MRAM_DQU8: U1.B9(VREFB8N0/DIFFIO_RX_T19p/DIFFOUT_T19p) U5.29(DQU8)
MRAM_DQU9: U1.C9(VREFB8N0/DIFFIO_RX_T12n/DIFFOUT_T12n) U5.30(DQU9)
MRAM_DQU10: U1.B10(VREFB8N0/DIFFIO_RX_T16n/DIFFOUT_T16n) U5.31(DQU10)
MRAM_DQU11: U1.A11(VREFB8N0/DIFFIO_RX_T17p/DIFFOUT_T17p) U5.32(DQU11)
MRAM_DQU12: U1.C10(VREFB8N0/DIFFIO_RX_T16p/DIFFOUT_T16p) U5.35(DQU12)
MRAM_DQU13: U1.A12(VREFB8N0/DIFFIO_RX_T17n/DIFFOUT_T17n) U5.36(DQU13)
MRAM_DQU14: U1.B11(VREFB8N0/DIFFIO_RX_T15n/DIFFOUT_T15n) U5.37(DQU14)
MRAM_DQU15: U1.B12(VREFB8N0/DIFFIO_RX_T15p/DIFFOUT_T15p) U5.38(DQU15)
MRAM_E: U1.G14(VREFB6N0/DIFFIO_RX_R22p/DIFFOUT_R22p) U5.6(E)
MRAM_G: U1.H16(VREFB6N0/DIFFIO_RX_R17n/DIFFOUT_R17n) U5.41(G)
MRAM_LB: U1.G15(VREFB6N0/DIFFIO_RX_R22n/DIFFOUT_R22n) U5.39(LB)
MRAM_UB: U1.H12(VREFB6N0/DIFFIO_RX_R20n/DIFFOUT_R20n) U5.40(UB)
MRAM_W: U1.F16(VREFB6N0/DIFFIO_RX_R23n/DIFFOUT_R23n) U5.17(W)
PMOD1-1: PMOD1.1 U1.R1(VREFB3N0/DIFFIO_RX_B2p/DIFFOUT_B2p)
PMOD1-2: PMOD1.2 U1.R2(VREFB3N0/DIFFIO_RX_B4p/DIFFOUT_B4p)
PMOD1-3: PMOD1.3 U1.P2(VREFB3N0/DIFFIO_RX_B2n/DIFFOUT_B2n)
PMOD1-4: PMOD1.4 U1.R3(VREFB3N0/DIFFIO_RX_B4n/DIFFOUT_B4n)
PMOD1-7: PMOD1.7 U1.N5(VREFB3N0/DIFFIO_TX_RX_B1p/DIFFOUT_B1p)
PMOD1-8: PMOD1.8 U1.P4(VREFB3N0/DIFFIO_TX_RX_B1n/DIFFOUT_B1n)
PMOD1-9: PMOD1.9 U1.L7(VREFB3N0/DIFFIO_TX_RX_B3p/DIFFOUT_B3p)
PMOD1-10: PMOD1.10 U1.M6(VREFB3N0/DIFFIO_TX_RX_B3n/DIFFOUT_B3n)
PMOD2-1: PMOD2.1 U1.R7(VREFB3N0/DIFFIO_TX_RX_B10n/DIFFOUT_B10n)
PMOD2-2: PMOD2.2 U1.R8(VREFB3N0/DIFFIO_RX_B11p/DIFFOUT_B11p)
PMOD2-3: PMOD2.3 U1.T5(VREFB3N0/DIFFIO_RX_B8n/DIFFOUT_B8n)
PMOD2-4: PMOD2.4 U1.R6(VREFB3N0/DIFFIO_TX_RX_B7n/DIFFOUT_B7n)
PMOD2-7: PMOD2.7 U1.R5(VREFB3N0/DIFFIO_TX_RX_B7p/DIFFOUT_B7p)
PMOD2-8: PMOD2.8 U1.T4(VREFB3N0/DIFFIO_RX_B8p/DIFFOUT_B8p)
PMOD2-9: PMOD2.9 U1.T3(VREFB3N0/DIFFIO_RX_B6n/DIFFOUT_B6n)
PMOD2-10: PMOD2.10 U1.T2(VREFB3N0/DIFFIO_RX_B6p/DIFFOUT_B6p)
PMOD3-1: PMOD3.1 U1.T11(VREFB3N0/DIFFIO_TX_RX_B16n/DIFFOUT_B16n)
PMOD3-2: PMOD3.2 U1.R10(VREFB3N0/DIFFIO_TX_RX_B16p/DIFFOUT_B16p)
PMOD3-3: PMOD3.3 U1.R9(VREFB3N0/DIFFIO_RX_B13p/DIFFOUT_B13p)
PMOD3-4: PMOD3.4 U1.M9(VREFB3N0/DIFFIO_TX_RX_B14p/DIFFOUT_B14p)
PMOD3-7: PMOD3.7 U1.T9(VREFB3N0/DIFFIO_RX_B13n/DIFFOUT_B13n)
PMOD3-8: PMOD3.8 U1.P9(VREFB3N0/DIFFIO_TX_RX_B12n/DIFFOUT_B12n)
PMOD3-9: PMOD3.9 U1.P8(VREFB3N0/DIFFIO_TX_RX_B12p/DIFFOUT_B12p)
PMOD3-10: PMOD3.10 U1.M8(VREFB3N0/DIFFIO_TX_RX_B14n/DIFFOUT_B14n)
RTN1: HD1.15 R18.1
RTN2: HD1.13 R22.1
RTN3: HD1.11 R31.1
RTN4: HD1.9 R37.1
TCK: JTAG1.1 U1.H3(VREFB1N0/TCK/DIFFIO_RX_L11p/DIFFOUT_L11p)
TDI: JTAG1.9 U1.G1(VREFB1N0/TDI/DIFFIO_RX_L12n/DIFFOUT_L12n)
TDO: JTAG1.3 U1.H1(VREFB1N0/TDO/DIFFIO_RX_L12p/DIFFOUT_L12p)
TMS: JTAG1.5 U1.H2(VREFB1N0/TMS/DIFFIO_RX_L11n/DIFFOUT_L11n)
USB_N: U14.7(DM) USB1.2(D-)
USB_P: U14.8(DP) USB1.3(D+)
Vbuss: C4.1 C5.1 J1.1 U2.A2(Vin) U2.B2(RUN2) U2.B3(Vin) U2.D2(RUN1) U2.D3(Vin) U2.E2(Vin)
VIN1: HD1.16 R19.1
VIN2: HD1.14 R23.1
VIN3: HD1.12 R32.1
VIN4: HD1.10 R39.1
VREF_ID: C50.2 C65.2 C73.2 C79.2 R20.2 R24.2 R34.2 R40.2 U12.1(Vouta) U12.2(ina-)
NetC13_1: C13.1 U3.1(REF/BYP)
NetC14_1: C14.1 U4.1(REF/BYP)
NetC15_1: C15.1 U3.2(ADJ)
NetC16_1: C16.1 U4.2(ADJ)
NetC21_2: C21.2 R2.2 R6.1 U6.8(ADJ)
NetC23_1: C23.1 U2.E3(TRACK/SS1)
NetC24_1: C24.1 U2.A3(TRACK/SS2)
NetC25_1: C25.1 U6.6(REF/BYP)
NetC35_1: C35.1 R16.1 R18.2 U8.2(ina-)
NetC50_1: C50.1 R19.2 R20.1 U8.3(ina+)
NetC58_1: C58.1 R21.1 R22.2 U8.6(inb-)
NetC65_1: C65.1 R23.2 R24.1 U8.5(+)
NetC70_1: C70.1 R27.1 R31.2 U9.2(ina-)
NetC71_1: C71.1 L4.2 U1.E4(ADC_VREF)
NetC73_1: C73.1 R32.2 R34.1 U9.3(ina+)
NetC77_1: C77.1 R36.1 R37.2 U9.6(inb-)
NetC79_1: C79.1 R39.2 R40.1 U9.5(+)
NetD3_2: D3.2(K) R5.2
NetLED1_4: LED1.4(Green_cath) R10.1
NetLED1_5: LED1.5(Red_cath) R9.1
NetLED1_6: LED1.6(Blue_cath) R8.1
NetLED2_4: LED2.4(Green_cath) R13.1
NetLED2_5: LED2.5(Red_cath) R12.1
NetLED2_6: LED2.6(Blue_cath) R11.1
NetLED3_4: LED3.4(Green_cath) R17.1
NetLED3_5: LED3.5(Red_cath) R15.1
NetLED3_6: LED3.6(Blue_cath) R14.1
NetR1_1: R1.1 U2.C4(FREQ)
NetR3_1: R3.1 U2.A4(FB2)
NetR4_1: R4.1 U2.E4(FB1)
NetR7_1: R7.1 U6.5(IMAX)
NetR25_2: R25.2 U14.14(RESET#)
NetR26_2: R26.2 U14.6(REF)
NetR28_2: R28.2 U10.5(CS) U14.63(EECS)
NetR29_2: R29.2 U10.4(CLK) U14.62(EECLK)
NetR30_2: R30.2 R33.1 U10.3(DI) U14.61(EEDATA)
NetR33_2: R33.2 U10.1(DO)
NetR35_2: R35.2 R38.1 U12.3(ina+) U13.2(Cathode)
NetR38_2: R38.2 U13.1(Ref)
NetR38_3: R38.3 R41.1
NetU1_K6: U1.K6(VREFB2N0/CLK1p/DIFFIO_RX_L20p/DIFFOUT_L20p) U1.L3(VREFB2N0/CLK0p/DIFFIO_RX_L18p/DIFFOUT_L18p) U7.4(Output)
NetU11_4: U11.4(Output) U14.2(OSCI)

Not connected (* = marked no-connect by the designer): JTAG1 6 7; U1 A9(VREFB8N0/VREFB8N0//) A10(VREFB8N0) A13(VREFB7N0/DIFFIO_RX_T10n/DIFFOUT_T10n) A14(VREFB7N0) A15(VREFB7N0/VREFB7N0) B4(VREFB8N0/DIFFIO_RX_T23p/DIFFOUT_T23p) B5(VREFB8N0/DIFFIO_RX_T22p/DIFFOUT_T22p) B6(VREFB8N0/DIFFIO_RX_T20p/DIFFOUT_T20p) B7(VREFB8N0/DIFFIO_RX_T18n/DIFFOUT_T18n) B8(VREFB8N0/DIFFIO_RX_T18p/DIFFOUT_T18p) B13(VREFB7N0/DIFFIO_RX_T10p/DIFFOUT_T10p) B15(VREFB6N0/VREFB6N0) B16(VREFB6N0) C3(VREFB1N0/ADC1IN16/DIFFIO_RX_L2p/DIFFOUT_L2p) C4(VREFB1N0/ADC1IN9/DIFFIO_RX_L2n/DIFFOUT_L2n) C5(VREFB8N0/DIFFIO_RX_T22n/DIFFOUT_T22n) C6(VREFB8N0/DIFFIO_RX_T20n/DIFFOUT_T20n) C12(VREFB7N0/DIFFIO_RX_T2n/DIFFOUT_T2n) C13(VREFB7N0/DIFFIO_RX_T2p/DIFFOUT_T2p) C16(VREFB6N0/DIFFIO_RX_R18n/DIFFOUT_R18n) D2(ANAIN1) D4(NC) D9(VREFB8N0/DIFFIO_RX_T12p/DIFFOUT_T12p) D12(VREFB7N0/DIFFIO_RX_T1p/DIFFOUT_T1p) D16(VREFB6N0/DIFFIO_RX_R18p/DIFFOUT_R18p) E3(VREFB1N0/ADC1IN11/DIFFIO_RX_L4n/DIFFOUT_L4n) E7(VREFB8N0/DIFFIO_RX_T24n/DIFFOUT_T24n) E8(VREFB8N0) E9(VREFB8N0/DIFFIO_RX_T14n/DIFFOUT_T14n) E10(VREFB7N0/DIFFIO_RX_T8n/DIFFOUT_T8n) E11(VREFB7N0/DIFFIO_RX_T1n/DIFFOUT_T1n) F2(VREFB1N0/ADC1IN12/DIFFIO_RX_L4p/DIFFOUT_L4p) F3(NC) F4(VREFB1N0/ADC1IN2/DIFFIO_RX_L1p/DIFFOUT_L1p) F5(VREFB1N0/ADC1IN1/DIFFIO_RX_L1n/DIFFOUT_L1n) F7(VREFB8N0/DIFFIO_RX_T24p/DIFFOUT_T24p) F8(VREFB8N0) F9(VREFB8N0/DIFFIO_RX_T14p/DIFFOUT_T14p) F10(VREFB7N0/DIFFIO_RX_T8p/DIFFOUT_T8p) F11(VREFB7N0/DIFFIO_RX_T3p/DIFFOUT_T3p) F12(VREFB7N0/DIFFIO_RX_T3n/DIFFOUT_T3n) G5(VREFB1N0/ADC1IN4/DIFFIO_RX_L3p/DIFFOUT_L3p) G11(VREFB6N0/DPCLK3/DIFFIO_RX_R26p/DIFFOUT_R26p) G12(VREFB6N0/DPCLK2/DIFFIO_RX_R26n/DIFFOUT_R26n) H5(VREFB1N0/ADC1IN3/DIFFIO_RX_L3n/DIFFOUT_L3n) H6(VREFB1N0/DIFFIO_RX_L14p/DIFFOUT_L14p) H11(VREFB6N0/DIFFIO_RX_R20p/DIFFOUT_R20p) J1(VREFB1N0/VREFB1N0) J2(VREFB1N0/DIFFIO_RX_L16p/DIFFOUT_L16p) J3(VREFB1N0/DIFFIO_RX_L16n/DIFFOUT_L16n) J5(VREFB1N0/DIFFIO_RX_L14n/DIFFOUT_L14n) J6(VREFB2N0/CLK1n/DIFFIO_RX_L20n/DIFFOUT_L20n) K2(VREFB2N0/DIFFIO_RX_L19p/DIFFOUT_L19p) K11(VREFB5N0/DIFFIO_RX_R8p/DIFFOUT_R8p) K12(VREFB5N0/DIFFIO_RX_R8n/DIFFOUT_R8n) K14(VREFB5N0/DIFFIO_RX_R10p/DIFFOUT_R10p) L1(VREFB2N0/DIFFIO_RX_L19n/DIFFOUT_L19n) L6(VREFB2N0/DIFFIO_RX_L25p/DIFFOUT_L25p) L8(VREFB3N0/DIFFIO_TX_RX_B9p/DIFFOUT_B9p) L11(VREFB5N0/DIFFIO_RX_R3p/DIFFOUT_R3p) L12(VREFB5N0/DIFFIO_RX_R3n/DIFFOUT_R3n) L15(VREFB5N0/DIFFIO_RX_R10n/DIFFOUT_R10n) L16(VREFB5N0/DIFFIO_RX_R11n/DIFFOUT_R11n) M3(VREFB2N0/CLK0n/DIFFIO_RX_L18n/DIFFOUT_L18n) M7(VREFB3N0/DIFFIO_TX_RX_B9n/DIFFOUT_B9n) M14(VREFB5N0/DIFFIO_RX_R6n/DIFFOUT_R6n) N13(NC) P5(VREFB3N0/DIFFIO_TX_RX_B5p/DIFFOUT_B5p) P6(VREFB3N0/DIFFIO_TX_RX_B10p/DIFFOUT_B10p) P10(VREFB4N0/DIFFIO_TX_RX_B18n/DIFFOUT_B18n) P11(VREFB4N0/DIFFIO_TX_RX_B18p/DIFFOUT_B18p) P14(VREFB5N0/DIFFIO_RX_R1p/DIFFOUT_R1p) R4(VREFB3N0/DIFFIO_TX_RX_B5n/DIFFOUT_B5n) R14(VREFB5N0/DIFFIO_RX_R1n/DIFFOUT_R1n) T6(VREFB3N0) T7(VREFB3N0/VREFB3N0) T8(VREFB3N0/DIFFIO_RX_B11n/DIFFOUT_B11n) T12(VREFB4N0) T13(VREFB4N0/VREFB4N0) T14(VREFB5N0/DIFFIO_RX_R2p/DIFFOUT_R2p) T15(VREFB5N0/DIFFIO_RX_R2n/DIFFOUT_R2n); U2 A5(COMP2) B4(PGOOD2) C3(INTVcc) D4(PGOOD1) E5(COMP1); U5 28(NC); U7 1(Tri-State) 2(NC) 5(NC); U11 1(Tri-State) 2(NC) 5(NC); U12 7(Voutb); U14 3(OSCO) 13(TEST) 26(ACBUS0) 27(ACBUS1) 28(ACBUS2) 29(ACBUS3) 30(ACBUS4) 32(ACBUS5) 33(ACBUS6) 34(ACBUS7) 36(SUSPEND#) 48(BCBUS0) 52(BCBUS1) 53(BCBUS2) 54(BCBUS3) 55(BCBUS4) 57(BCBUS5) 58(BCBUS6) 59(BCBUS7) 60(PWREN#)

## Layout directives
differential pair: USB_N, USB_P

## Notes on the sheet
- (in symbol IC FPGA MAX10, part A) BANK 5; BANK 1A; BANK 1B; BANK 6; BANK 2; BANK 7; BANK 3; BANK 8; BANK 4
- (in symbol IC OP AMP DUAL LTC6014CDD DFN8, part A) -
- (in symbol IC OP AMP DUAL LTC6014CDD DFN8, part B) -
- (in symbol LED RGB 6pin SMT 0404) Blue; Red; Green
- (in symbol Res Pot 500 11T 125mW SMT_1) clkwise

## Library data of the parts
C1-C3 C27-C34 C36-C49 C51-C56 C59-C64 C66-C69 C71 C72 C74-C76 C78 = Cap 1.0uF 6.3V 0402 X7R: Capacitor 1.0uF 6.3V 10% 0402 X7R; Manufacture: Yageo; Manufacture Part Number: CC0402KRX7R5BB105; Supplier 1: Mouser; Supplier 2: Digi-Key; Supplier Part Number 1: 603-CC402KRX7R5BB105; Supplier Part Number 2: 311-1702-6-ND
C4 C5 = Cap 22uF 25V 1210 X7R: Capacitor 22uF 25V 10% 1210 X7R; Manufacture: Murata; Manufacture Part Number: GRM32ER71E226KE5L; Supplier 1: Mouser; Supplier 2: Mouser; Supplier 3: Digi-Key; Supplier Part Number 1: 81-GRM32ER71E226KE5L; Supplier Part Number 2: 80-C1210C226K3R; Supplier Part Number 3: 1276-3391-1-ND; Date Created: 20151201
C6-C9 C12 C18-C20 C22 C57 = Cap 10uF 10V 0805 X7R: Capacitor 10uF 10V 10% 0805 X7R; Manufacture: Yageo; Manufacture Part Number: CC0805KKX7R6BB106; Supplier 1: Digi-Key; Supplier 2: Farnell; Supplier Part Number 1: 311-1879-1-ND; Supplier Part Number 2: 2368960
C10 C11 C26 = Cap 2.2uF 25V X7R 0805: Capacitor 2.2uF 25V 5% 0805 X7R; Supplier 1: Digi-Key; Supplier 2: Digi-Key; Supplier Part Number 1: 445-6965-6-ND; Supplier Part Number 2: 587-2991-6-ND
C13-C16 C25 = Cap 0.01uF 50V 0402 X7R: Capacitor 0.01uF 50V10% 0402 X7R; Manufacture: Yageo; Manufacture Part Number: CC0402KRX7R9BB103; Supplier 1: Mouser; Supplier 2: Digi-Key; Supplier Part Number 1: 603-CC402KRX7R9BB103; Supplier Part Number 2: 311-1349-1-ND
C17 = Cap 22uF 10V 1206 X7R: Capacitor 22uF 10V 10% 1206 X7R; Manufacture: Yageo; Manufacture Part Number: CC1206MKX7R6BB226; Supplier 1: Digi-Key; Supplier 2: Farnell; Supplier Part Number 1: 311-2002-1-ND; Supplier Part Number 2: 2218909
C21 = Cap 0.001uF 50V 0402 X7R: Capacitor 0.001uF 50V10% 0402 X7R; Manufacture: Yageo; Manufacture Part Number: CC0402KRX7R9BB102; Supplier 1: Mouser; Supplier 2: Digi-Key; Supplier Part Number 1: 603-CC402KRX7R9BB102; Supplier Part Number 2: 311-1036-1-ND
C23 C24 = Cap 0.1uF 50V 0402 X7R: Capacitor 0.1uF 50V 10% 0402 X7R; Manufacture: Yageo; Manufacture Part Number: CC0402KRX7R9BB104; Supplier 1: Farnell; Supplier 2: Mouser; Supplier 3: Farnell; Supplier Part Number 1: 1833861; Supplier Part Number 2: 80-C0402C104K4R; Supplier Part Number 3: 2429353
C35 C50 C58 C65 C70 C73 C77 C79 = Cap 47pF 50V 0402 NPO: Capacitor 47pF 50V 10% 0402 NPO; Manufacture: AVX; Manufacture Part Number: 04025A470JAT2A; Supplier 1: Newark; Supplier 2: Digi-Key; Supplier 3: Mouser; Supplier Part Number 1: 96M1153; Supplier Part Number 2: 478-1078-6-ND; Supplier Part Number 3: 603-AC0402JR9BN470
D1 D2 = Diode 40V 3A SMA CDBA340L-HF: Manufacturer: Comchip; Supplier 1: Digi-Key; Supplier 2: Mouser; Supplier Part Number 1: 641-1702-1-ND; Supplier Part Number 2: 750-CDBA340L-HF; Manufacturer Part Number: CDBA340L-HF
D3 = LED Green 0402: Manufacture Part Number: SML-P11YT; Manufacture: Rohm; Supplier 1: Digi-Key; Supplier 2: Mouser; Supplier Part Number 1: 511-1652-1-ND; Supplier Part Number 2: 755-SML-P11MTT86
HD1 = Conn Recept 8x2x0.1 TH SSW_1_1: Manufature: Samtec; Manufacture Part number: SSW-108-xx-G-D; Supplier 1: Digi-Key; Supplier 2: Farnell; Supplier Part Number 1: SAM1214-08-ND; Supplier Part Number 2: 1668364
J1 = Conn PWR 2.0 5A 24V TH Barrel: Manufacture Part Number: KLDHCX-0202-A; Manufacture: Kycon; ComponentLink1URL: http://domino.kycon.com/internet/Products.html; Supplier 1: Mouser; Supplier 2: Mouser; Supplier Part Number 1: 806-KLDHCX-0202-A-LT; Supplier Part Number 2: 806-KLDHCX-0202-A
J2 = Header 2x2x100 Samtec TSW-07: Header 2x2x100pitch Pin TSW; Manufature: Samtec; Manufacture Part Number: TSW-102-07-G-D; Supplier 1: Digi-Key; Supplier 2: Newark; Supplier Part Number 1: HTSW-102-07-G-D-ND; Supplier Part Number 2: 12P1257
JTAG1 = Header 2x5 100PH SamtecTSW_2: Header 2x5x100pitch Pin TSW; Manufature: Samtec; Manufacture Part number: TSW-105-07-G-D; Supplier 1: Digi-Key; Supplier 2: Arrow; Supplier 3: Farnell; Supplier Part Number 1: HTSW-105-07-G-D-ND; Supplier Part Number 2: vhWTpuTKCcs3C_TdRGpLCLgt6TM2wgVjnAWb2rFNMs4; Supplier Part Number 3: 2025251
L1-L4 = FBead 500mA 80mohm 0402: Ferrite Bead 500mA 80mohm 0402; Manufacturer Part Number: BLM15BB050SN1D; Manufacturer: Murata; Supplier 1: Mouser; Supplier 2: Digi-Key; Supplier Part Number 1: 81-BLM15BB050SN1D; Supplier Part Number 2: 490-5185-1-ND; Value: 0.5A
LED1-LED3 = LED RGB 6pin SMT 0404: Manufacture Part Number: SMLP36RGB2W3; Manufacture: Rohm; Supplier 1: Mouser; Supplier 2: Digi-Key; Supplier Part Number 1: 755-SMLP36RGB2W3R; Supplier Part Number 2: 846-1097-1-ND
PMOD1-PMOD3 = Conn Recept 6x2x0.1 TH SSW_1_1: Manufature: Samtec; Manufacture Part number: SSW-106-xx-G-D; Supplier 1: Digi-Key; Supplier 2: Farnell; Supplier Part Number 1: SAM1214-06-ND; Supplier Part Number 2: 1668354
R1 = Res 324K 60mW 1% 0402: Resistor 324K 60mW 1% 0402 ThickFilm; Manufacture: Vishay; Manufacture Part Number: CRCW0402324KFK; Supplier 1: Digi-Key; Supplier 2: Digi-Key; Supplier Part Number 1: P324KLDKR-ND; Supplier Part Number 2: YAG3117DKR-ND; Value: 324K
R2 = Res 61.9K 60mW 1% 0402: Resistor 61.9K 60mW 1% 0402 ThickFilm; Manufacture: Vishay; Manufacture Part Number: CRCW040261K9FK; Supplier 1: Mouser; Supplier 2: Digi-Key; Supplier 3: Digi-Key; Supplier Part Number 1: 71-CRCW0402-61.9K-E3; Supplier Part Number 2: 311-61.9KLRDKR-ND; Supplier Part Number 3: P61.9KLCT-ND; Value: 61.9K
R3 = Res 60.4K 60mW 1% 0402: Resistor 60.4K 60mW 1% 0402 ThickFilm; Manufacture: Vishay; Manufacture Part Number: CRCW040260K4FK; Supplier 1: Digi-Key; Supplier 2: Mouser; Supplier 3: Newark; Supplier Part Number 1: P60.4KLCT-ND; Supplier Part Number 2: 660-RK73H1ETTP6042F; Supplier Part Number 3: 52K7190; Value: 60.4K
R4 = Res 13.3K 60mW 1% 0402: Resistor 13.3K 60mW 1% 0402 ThickFilm; Manufacture: Vishay; Manufacture Part Number: CRCW040213K3FK; Supplier 1: Mouser; Supplier 2: Digi-Key; Supplier Part Number 1: 71-CRCW0402-13.3K-E3; Supplier Part Number 2: P13.3KLDKR-ND; Value: 13.3K
R5 = Res 715 60mW 1% 0402: Resistor 715 60mW 1% 0402 ThickFilm; Manufacture: Vishay; Manufacture Part Number: CRCW0402715RFK; Supplier 1: Allied; Supplier 2: Newark; Supplier Part Number 1: 70268411; Supplier Part Number 2: 52K7255; Value: 715
R6 = Res 280K 60mW 1% 0402: Resistor 280K 60mW 1% 0402 ThickFilm; Manufacture: Vishay; Manufacture Part Number: CRCW0402280KFK; Supplier 1: Digi-Key; Supplier 2: Mouser; Supplier 3: Newark; Supplier Part Number 1: P280KLCT-ND; Supplier Part Number 2: 71-CRCW0402-280K-E3; Supplier Part Number 3: 52K8360; Value: 280K
R7 R35 = Res 150 60mW 1% 0402: Resistor 150 60mW 1% 0402 ThickFilm; Manufacture: Vishay; Manufacture Part Number: CRCW0402150RFK; Supplier 1: Digi-Key; Supplier 2: Arrow; Supplier Part Number 1: P150LCT-ND; Supplier Part Number 2: _UdCBwdjy3obOljgOkNRlLXUS9QReSEZRvzSt6pzZbA; Value: 150
R8 R10 R11 R13 R14 R17 = Res 100 60mW 1% 0402: Resistor 100 60mW 1% 0402 ThickFilm; Manufacture: Vishay; Manufacture Part Number: CRCW0402100RFK; Supplier 1: Newark; Supplier 2: Mouser; Supplier Part Number 1: 65T8246; Supplier Part Number 2: 71-CRCW0402-100-E3; Value: 100
R9 R12 R15 = Res 392 60mW 1% 0402: Resistor 392 60mW 1% 0402 ThickFilm; Manufacture: Vishay; Manufacture Part Number: CRCW0402392RFK; Supplier 1: Newark; Supplier 2: Newark; Supplier Part Number 1: 53W4357; Supplier Part Number 2: 52K7033; Value: 392
R16 R18-R24 R27 R31 R32 R34 R36 R37 R39 R40 = Res 1.0K 60mW 1% 0402: Resistor 1.0K 60mW 1% 0402 ThickFilm; Manufacture: Vishay; Manufacture Part Number: CRCW04021K00FK; Supplier 1: Digi-Key; Supplier 2: Digi-Key; Supplier Part Number 1: 311-1.00KLRDKR-ND; Supplier Part Number 2: P1.00KLDKR-ND; Value: 1.0K
R25 R33 = Res 2.21K 60mW 1% 0402: Resistor 2.21K 60mW 1% 0402 ThickFilm; Manufacture: Vishay; Manufacture Part Number: CRCW04022K21FK; Supplier 1: Newark; Supplier Part Number 1: 52K6795; Value: 2.21K
R26 R28-R30 = Res 10K 60mW 1% 0402: Resistor 10K 60mW 1% 0402 ThickFilm; Manufacture: Vishay; Manufacture Part Number: CRCW040210K0FK; Supplier 1: Digi-Key; Supplier 2: Mouser; Supplier Part Number 1: 541-10.0KLCT-ND; Supplier Part Number 2: 71-CRCW040210K0FKEDH; Value: 10K
R38 = Res Pot 500 11T 125mW SMT_1: Res Pot 500 11T 125mW SMT; Manufacture: Bourns; Manufacture Part number: 3223W-1-501E; Value: 500; Rating: 125mW; Date Created: 20151205; Supplier 1: Mouser; Supplier 2: Digi-Key; Supplier Part Number 1: 652-3223W-1-501E; Supplier Part Number 2: 3223W-1-501-ND
R41 = Res 12.4k 60mW 0.1% 0402: Resistor 12.4k 60mW 0.1% 0402 ThickFilm; Manufacture: Vishay; Manufacture Part Number: TNPW040212K4BE; Supplier 1: Mouser; Supplier 2: Mouser; Supplier Part Number 1: 71-TNPW040212K4BEED; Supplier Part Number 2: 667-ERA-2AEB1242X; Value: 12.4k
Shunt1 Shunt2 = Shunt 2x1: Shunt 2x1x0p1; Manufacture: Samtec; Supplier 1: Newark; Supplier 2: Digi-Key; Supplier Part Number 1: 73J7699; Supplier Part Number 2: SAM8859-ND
U1 = IC FPGA MAX10: Manufacture Part Number: 10M08DA
U2 = IC LTM4622 IC uModule Buck Reg Dual LGA25: IC uModule Buck Reg Dual LGA25
U3 = IC LDO 1.2V 100mA DFN-8: Manufacture Part Number: LT3060EDC-1.2#PBF; Manufacture: Linear Tech; Supplier 1: Digi-Key; Supplier 2: Farnell; Supplier Part Number 1: LT3060EDC-1.2#TRMPBFCT-ND; Supplier Part Number 2: 1847534
U4 = IC LDO 2.5V 100mA DFN-8_1: IC LDO 2.5V 100mA DFN-8; Manufacture Part Number: LT3060EDC-2.5#PBF; Manufacture: Linear Tech; Supplier 1: Farnell; Supplier 2: Digi-Key; Supplier Part Number 1: 1847560; Supplier Part Number 2: LT3060EDC-2.5#TRMPBFCT-ND
U5 = IC MRAM 64kx16bit 3p3V TSOP44: Manufacture Part Number 2: MR0A16AYS35; Manufacture 2: Freescale; Manufacture: Everspin; Manufactre Part Number: MR0A16AYS35; Supplier 1: Arrow; Supplier 2: Digi-Key; Supplier 3: Mouser; Supplier Part Number 1: B4Q21rVtnqEuJmeLu3aJqtf0FmB5U2dFJxqnPlHgI0U; Supplier Part Number 2: 819-1007-ND; Supplier Part Number 3: 936-MR0A16AYS35
U6 = IC LT3065-adj LDO 500mA: LT3065-adj LDO 500mA; Supplier 1: Digi-Key; Supplier Part Number 1: LT3065EDD#PBF-ND
U7 = Oss 50Mz 50ppm SMT: Oss 50MHz 50ppm SMT; Manufacture Part Number: ASVMPC-50.000MHz-Z; Manufacture: ABRACON; Supplier 1: Digi-Key; Supplier 2: Newark; Supplier Part Number 1: 535-11471-1-ND; Supplier Part Number 2: 48T0390
U8 U9 U12 = IC OP AMP DUAL LTC6014CDD DFN8: IC OP AMP Dual LTC6014 DFN8; Manufacture: Linear Tech; Manufacture Part Number: LT6014CDD; Supplier 1: Arrow; Supplier 2: Digi-Key; Supplier Part Number 1: uKpW_5dmtUtafZa5co9qr3GCxMVrocqlPAusvbOwVqo; Supplier Part Number 2: LT6014CDD#PBF-ND
U10 = IC 93LC46BTEOT EEPROM: IC EEPROM Serial  SOT23 6Pin; Supplier 2: Mouser; Supplier Part Number 2: 579-93LC46BT-E/OT; Supplier 1: Mouser; Supplier 3: Allied; Supplier Part Number 1: 579-93LC46BT-E/OT; Supplier Part Number 3: 70571703
U11 = Oss 12MHz 50ppm SMT_1: Oss 12MHz 50ppm SMT; Manufacture Part Number: ASVMPC-12.000MHz-Z; Manufacture: ABRACON; Supplier 1: Mouser; Supplier 2: Digi-Key; Supplier Part Number 1: 815-ASVMPC-12ZT; Supplier Part Number 2: ASVMPC-12.000MHZ-Z-T-ND
U13 = Reg 1p24V Precision Adj Shunt SPX432: IC, Reg 1.24V Precision Adj Shunt SOT23 SPX432; Manufacture: SIPEX; Manufacture Part Number: SPX432; Date Created: 20151202; Supplier 1: Digi-Key; Supplier 2: Mouser; Supplier Part Number 1: 1016-1415-ND; Supplier Part Number 2: 701-SPX432AM-L
U14 = IC FT2232HL-Tray: Dual High Speed USB To Multipurpose UART/FIFO IC, 64-pin LQFP, Tray; Manufacturer: FTDI; DatasheetVersion: ver 2.21, Jun-2012; PackageVersion: Jun-12; PackageReference: LQFP-64; PackageDescription: 64-Pin Thin Quad Flat Pack, 10 x 10 x 1.4 mm Body, 0.5 mm Pitch; PartNumber: FT2232HL-Tray; ComponentLink1Description: Manufacturer URL; ComponentLink1URL: http://www.ftdichip.com/; ComponentLink2Description: Datasheet; ComponentLink2URL: http://www.ftdichip.com/Support/Documents/DataSheets/ICs/DS_FT2232H.pdf
USB1 = Conn USB A 4Pin TH RT: Connector USB A 4Pin TH RT; Supplier 1: Newark; Supplier 2: Digi-Key; Supplier 3: Mouser; Supplier 4: Arrow; Supplier Part Number 1: 01J8374; Supplier Part Number 2: WM17117-ND; Supplier Part Number 3: 538-48037-0001; Supplier Part Number 4: zAc_MAfs4zVJ_QhPoMB0GZu3CPMjh44DToxilnH02fA